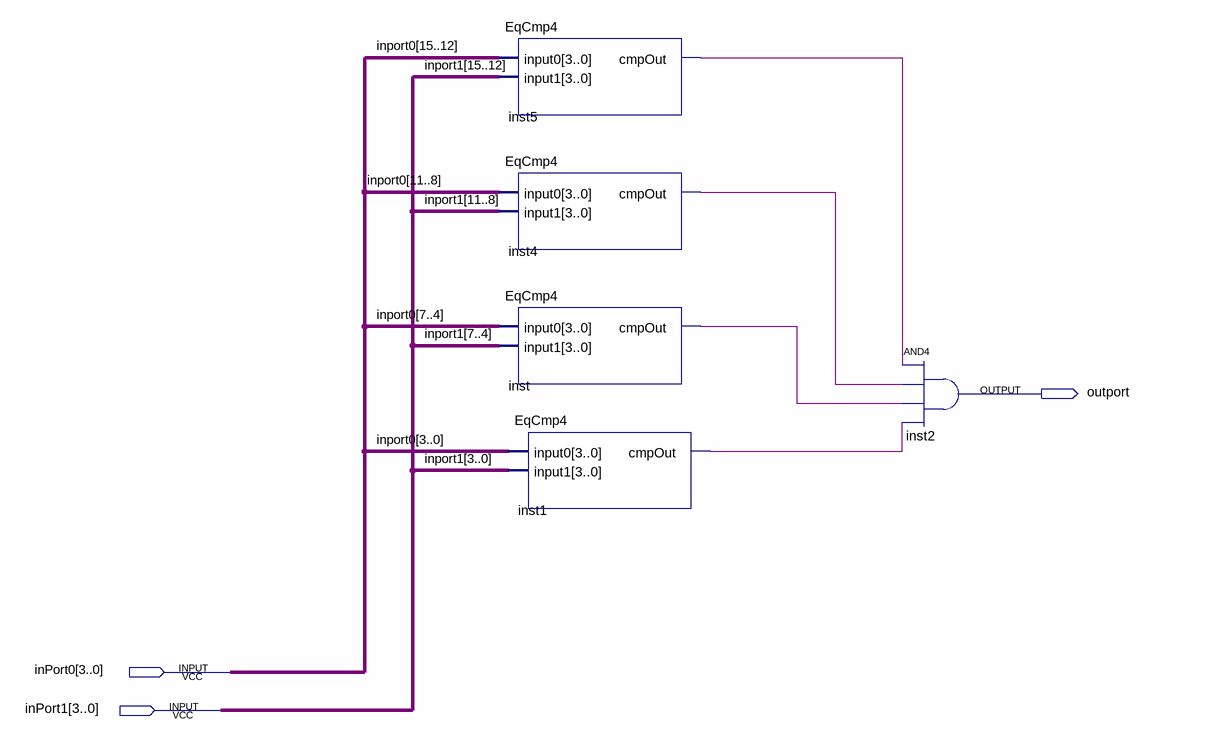
[diagram p0: schematic sheet]
// Quartus schematic EqCmp4_3.bdf as structural Verilog: 5 symbols, 3 pins
module EqCmp4_3 (
  input  [15:0] inPort0,
  input  [15:0] inPort1,
  output outport
);

  wire inst1_cmpout, inst4_cmpout, inst5_cmpout, inst_cmpout;

  EqCmp4 inst5 (.input0(inPort0[15:12]), .input1(inPort1[15:12]), .cmpOut(inst5_cmpout));
  EqCmp4 inst4 (.input0(inPort0[11:8]), .input1(inPort1[11:8]), .cmpOut(inst4_cmpout));
  EqCmp4 inst (.input0(inPort0[7:4]), .input1(inPort1[7:4]), .cmpOut(inst_cmpout));
  EqCmp4 inst1 (.input0(inPort0[3:0]), .input1(inPort1[3:0]), .cmpOut(inst1_cmpout));
  and inst2 (outport, inst5_cmpout, inst4_cmpout, inst_cmpout, inst1_cmpout);
endmodule
